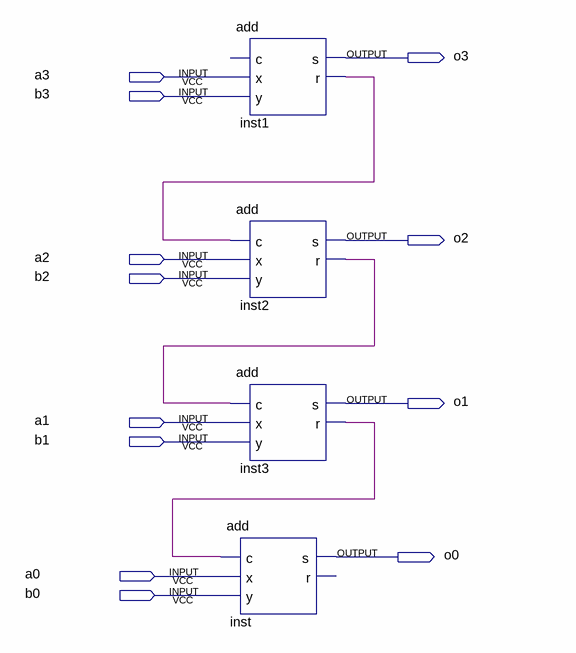
[diagram p0: schematic sheet]
// Quartus schematic add4.bdf as structural Verilog: 4 symbols, 12 pins
module add4 (
  input  a3,
  input  b3,
  input  a2,
  input  b2,
  input  a1,
  input  b1,
  input  a0,
  input  b0,
  output o3,
  output o2,
  output o1,
  output o0
);

  wire inst1_r, inst2_r, inst3_r;

  add inst1 (.x(a3), .y(b3), .s(o3), .r(inst1_r));  // open: c
  add inst2 (.c(inst1_r), .x(a2), .y(b2), .s(o2), .r(inst2_r));
  add inst3 (.c(inst2_r), .x(a1), .y(b1), .s(o1), .r(inst3_r));
  add inst (.c(inst3_r), .x(a0), .y(b0), .s(o0));  // open: r
endmodule
